# EAGLE schematic MECHWARFARE_BOARD (EAGLE 9.6.2)
AUTHOR: Cole Stanton / Aaron Tran; BOARD_NAME: 507 PROTOTYPE; DOC_NUM: 1; PROJECT_NAME: 507 DESIGN PROJECT; REVISION: 0
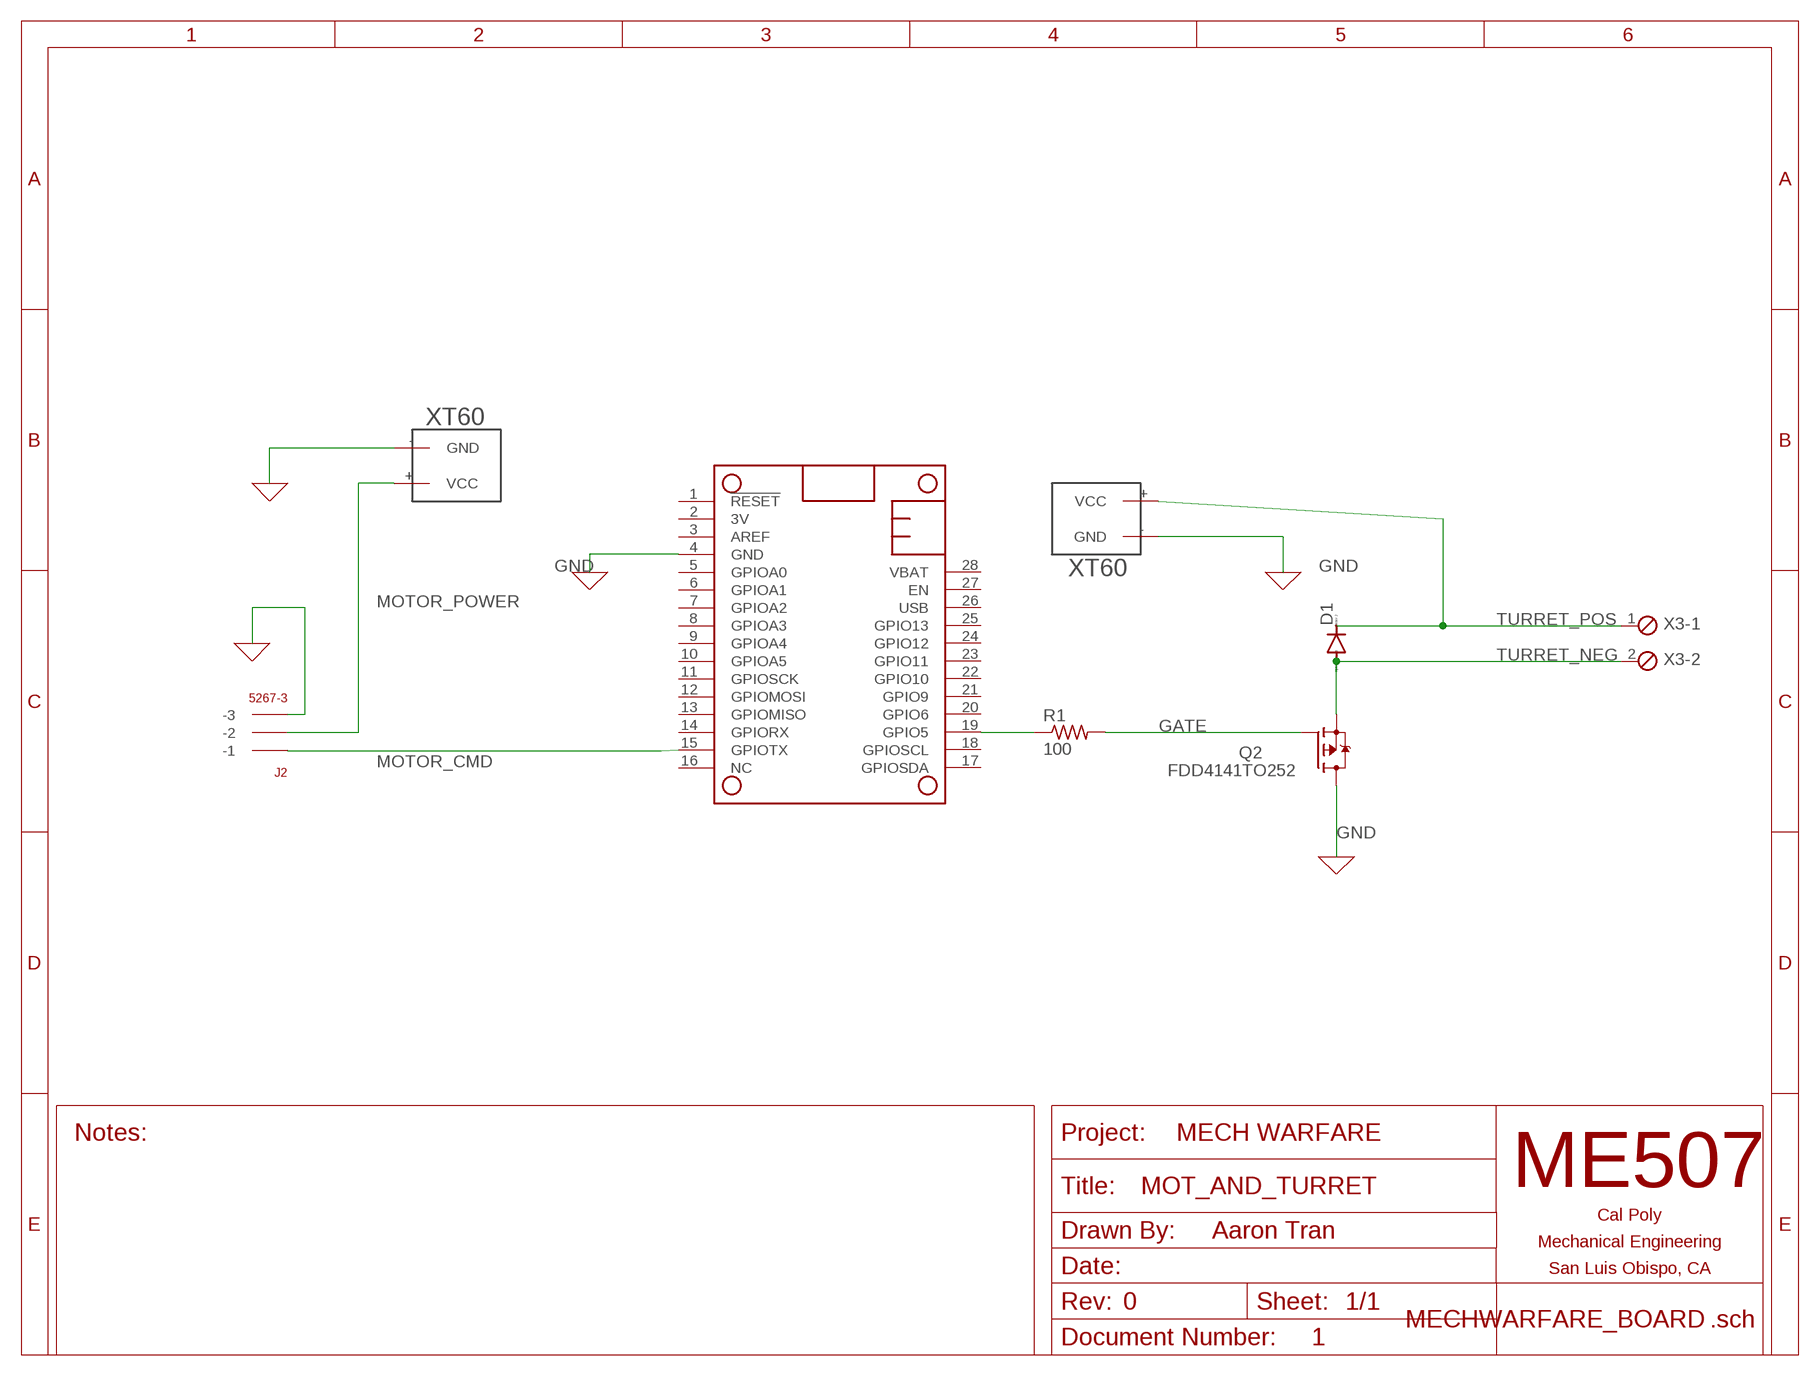
[diagram p0: schematic, sheet 1]
FRAME1 (TITLEBLOCK_LET_L): AUTHOR: Aaron Tran; BOARD_NAME: MOT_AND_TURRET; PROJECT_NAME: MECH WARFARE

## Parts
D1  DIODE-DO-214AC  [DO-214AC]
J2  5267-3  [5267-3]
MS2  FEATHERWINGEXTENDED_BOTH_ENDS  [FEATHERWING]
Q2  FDD4141TO252  [TO252]
R1  100  R-US_R0805  [R0805]
U$1  XT60  [XT60]
U$2  XT60  [XT60]
X3  SCREWTERM_2P_254  [2POL254]

## Nets
GATE: Q2.1(G) R1.2
GND: J2.P$3(-3) MS2.4(GND) Q2.3(D) U$1.-(GND) U$2.-(GND)
MOTOR_CMD: J2.P$1(-1) MS2.15(GPIOTX)
MOTOR_POWER: J2.P$2(-2) U$1.+(VCC)
N$21: MS2.19(GPIO5) R1.1
TURRET_NEG: D1.A Q2.2(S) X3.2
TURRET_POS: D1.C U$2.+(VCC) X3.1
Unconnected: MS2.1(!RESET) MS2.2(3V) MS2.3(AREF) MS2.5(GPIOA0) MS2.6(GPIOA1) MS2.7(GPIOA2) MS2.8(GPIOA3) MS2.9(GPIOA4) MS2.10(GPIOA5) MS2.11(GPIOSCK) MS2.12(GPIOMOSI) MS2.13(GPIOMISO) MS2.14(GPIORX) MS2.16(NC) MS2.17(GPIOSDA) MS2.18(GPIOSCL) MS2.20(GPIO6) MS2.21(GPIO9) MS2.22(GPIO10) MS2.23(GPIO11) MS2.24(GPIO12) MS2.25(GPIO13) MS2.26(USB) MS2.27(EN) MS2.28(VBAT)

## Library data of the parts
D1 = diode:DIODE-: DIODE
J2 = con-molex-spox:5267-3
MS2 = ME507:FEATHERWING: AdaFruitTM Feather Wing A modified version of a Featherwing, the add-on board for an AdaFruit(tm) Feather development board. There is a standard size version which is the same size as the Feather board on which the microcontroller hangs out. There is also an extended version, with each and longer by a quarter inch to allow for connectors such as screw terminals which aren't hidden under another board if this wing isn't on the top of the board stack. The pins are named in a generic fashion; these names do not necessarily correspond to Arduino or Python pin numbers. The designer must refer to the pinout diagram for each specific Feather board to find the functions of each pin.
Q2 = transistor-fet:FDD4141: P-Channel PowerTrench® MOSFET Source: FDD4141.pdf
R1 = rcl:R-US_: RESISTOR, American symbol; SPICEPREFIX: R
U$1 U$2 = XT60:XT60: XT60
X3 = ME507:SCREWTERM_2P: Screw Terminal Block This part is designed for a screw terminal connector. The 2.54mm (0.100 inch) foorprint can also be used for male or female pin headers such as those on most development boards. One can also solder wires directly into the holes, though this makes modifications or repairs to the system more inconvenient. Larger versions can carry more current.